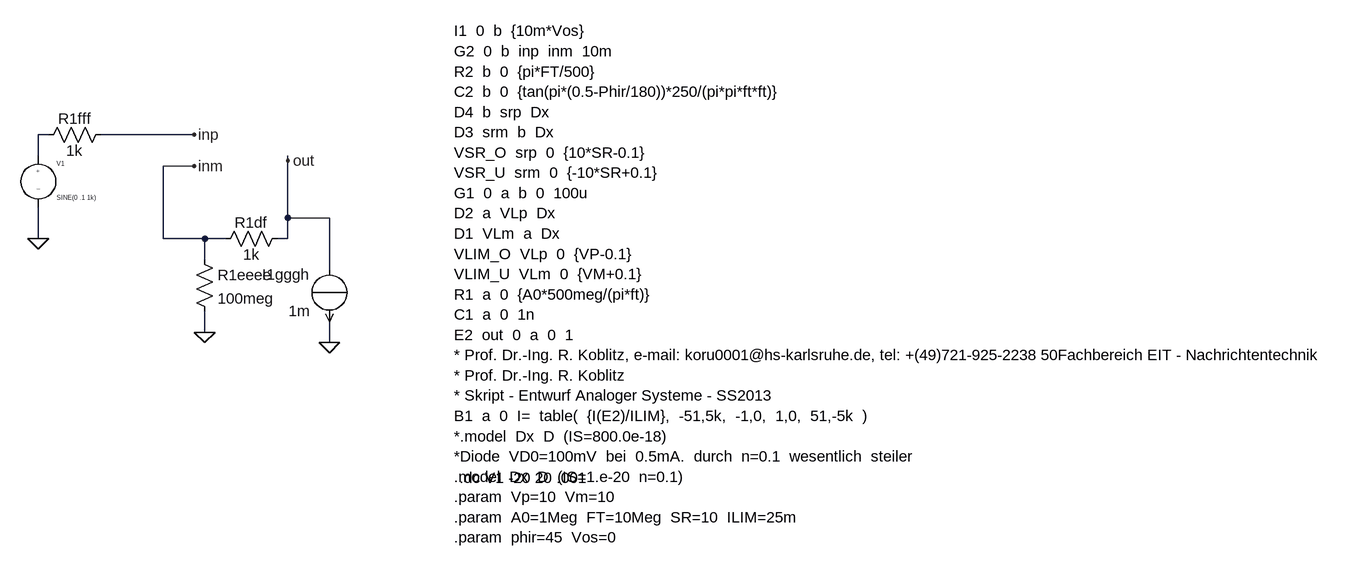
[diagram p0: schematic op_macromodel_koblitz_beta.asc]
op_macromodel_koblitz_beta.asc, the LTspice schematic file:
Version 4
SHEET 1 1380 768
WIRE -608 224 -624 224
WIRE -384 224 -528 224
WIRE -624 256 -624 224
WIRE -240 264 -240 256
WIRE -384 272 -432 272
WIRE -240 352 -240 264
WIRE -176 352 -240 352
WIRE -624 384 -624 336
WIRE -432 384 -432 272
WIRE -368 384 -432 384
WIRE -336 384 -368 384
WIRE -240 384 -240 352
WIRE -240 384 -256 384
WIRE -368 416 -368 384
WIRE -176 432 -176 352
WIRE -368 528 -368 496
WIRE -176 544 -176 512
FLAG -384 224 inp
FLAG -384 272 inm
FLAG -624 384 0
FLAG -240 264 out
FLAG -368 528 0
FLAG -176 544 0
SYMBOL source-V -624 240 R0
WINDOW 123 0 0 Left 2
WINDOW 39 0 0 Left 2
SYMATTR InstName V1
SYMATTR Value SINE(0 .1 1k)
SYMBOL res -624 240 R270
WINDOW 0 25 56 VTop 2
WINDOW 3 7 56 VBottom 2
SYMATTR InstName R1fff
SYMATTR Value 1k
SYMBOL res -384 400 R0
SYMATTR InstName R1eeee
SYMATTR Value 100meg
SYMBOL res -240 368 R90
WINDOW 0 7 56 VBottom 2
WINDOW 3 25 56 VTop 2
SYMATTR InstName R1df
SYMATTR Value 1k
SYMBOL source-I -176 512 R180
WINDOW 0 29 73 Left 2
WINDOW 3 29 17 Left 2
WINDOW 123 0 0 Left 2
WINDOW 39 0 0 Left 2
SYMATTR InstName I1gggh
SYMATTR Value 1m
TEXT 16 64 Left 2 !I1  0  b  {10m*Vos}\nG2  0  b  inp  inm  10m\nR2  b  0  {pi*FT/500}\nC2  b  0  {tan(pi*(0.5-Phir/180))*250/(pi*pi*ft*ft)}\nD4  b  srp  Dx\nD3  srm  b  Dx\nVSR_O  srp  0  {10*SR-0.1}\nVSR_U  srm  0  {-10*SR+0.1}\nG1  0  a  b  0  100u\nD2  a  VLp  Dx\nD1  VLm  a  Dx\nVLIM_O  VLp  0  {VP-0.1}\nVLIM_U  VLm  0  {VM+0.1}\nR1  a  0  {A0*500meg/(pi*ft)}\nC1  a  0  1n\nE2  out  0  a  0  1\n* Prof. Dr.-Ing. R. Koblitz, e-mail: koru0001@hs-karlsruhe.de, tel: +(49)721-925-2238 50Fachbereich EIT - Nachrichtentechnik\n* Prof. Dr.-Ing. R. Koblitz\n* Skript - Entwurf Analoger Systeme - SS2013\nB1  a  0  I=  table(  {I(E2)/ILIM},  -51,5k,  -1,0,  1,0,  51,-5k  )\n*.model  Dx  D  (IS=800.0e-18)\n*Diode  VD0=100mV  bei  0.5mA.  durch  n=0.1  wesentlich  steiler\n.model  Dx  D  (IS=1.e-20  n=0.1)\n.param  Vp=10  Vm=10\n.param  A0=1Meg  FT=10Meg  SR=10  ILIM=25m\n.param  phir=45  Vos=0
TEXT 24 752 Left 2 !.dc V1 -20 20 .001

The netlist it stands for:
* op_macromodel_koblitz_beta.asc
V1 N001 0 SINE(0 .1 1k)
R1fff N001 inp 1k
R1eeee inm 0 100meg
R1df out inm 1k
I1gggh out 0 1m
I1  0  b  {10m*Vos}
G2  0  b  inp  inm  10m
R2  b  0  {pi*FT/500}
C2  b  0  {tan(pi*(0.5-Phir/180))*250/(pi*pi*ft*ft)}
D4  b  srp  Dx
D3  srm  b  Dx
VSR_O  srp  0  {10*SR-0.1}
VSR_U  srm  0  {-10*SR+0.1}
G1  0  a  b  0  100u
D2  a  VLp  Dx
D1  VLm  a  Dx
VLIM_O  VLp  0  {VP-0.1}
VLIM_U  VLm  0  {VM+0.1}
R1  a  0  {A0*500meg/(pi*ft)}
C1  a  0  1n
E2  out  0  a  0  1
* Prof. Dr.-Ing. R. Koblitz, e-mail: koru0001@hs-karlsruhe.de, tel: +(49)721-925-2238 50Fachbereich EIT - Nachrichtentechnik
* Prof. Dr.-Ing. R. Koblitz
* Skript - Entwurf Analoger Systeme - SS2013
B1  a  0  I=  table(  {I(E2)/ILIM},  -51,5k,  -1,0,  1,0,  51,-5k  )
*.model  Dx  D  (IS=800.0e-18)
*Diode  VD0=100mV  bei  0.5mA.  durch  n=0.1  wesentlich  steiler
.model  Dx  D  (IS=1.e-20  n=0.1)
.param  Vp=10  Vm=10
.param  A0=1Meg  FT=10Meg  SR=10  ILIM=25m
.param  phir=45  Vos=0
.dc V1 -20 20 .001
.backanno
.end